# Altium schematic sheet Large_Connector.SchDoc
size A4; SheetNumber: 8; SheetTotal: 10
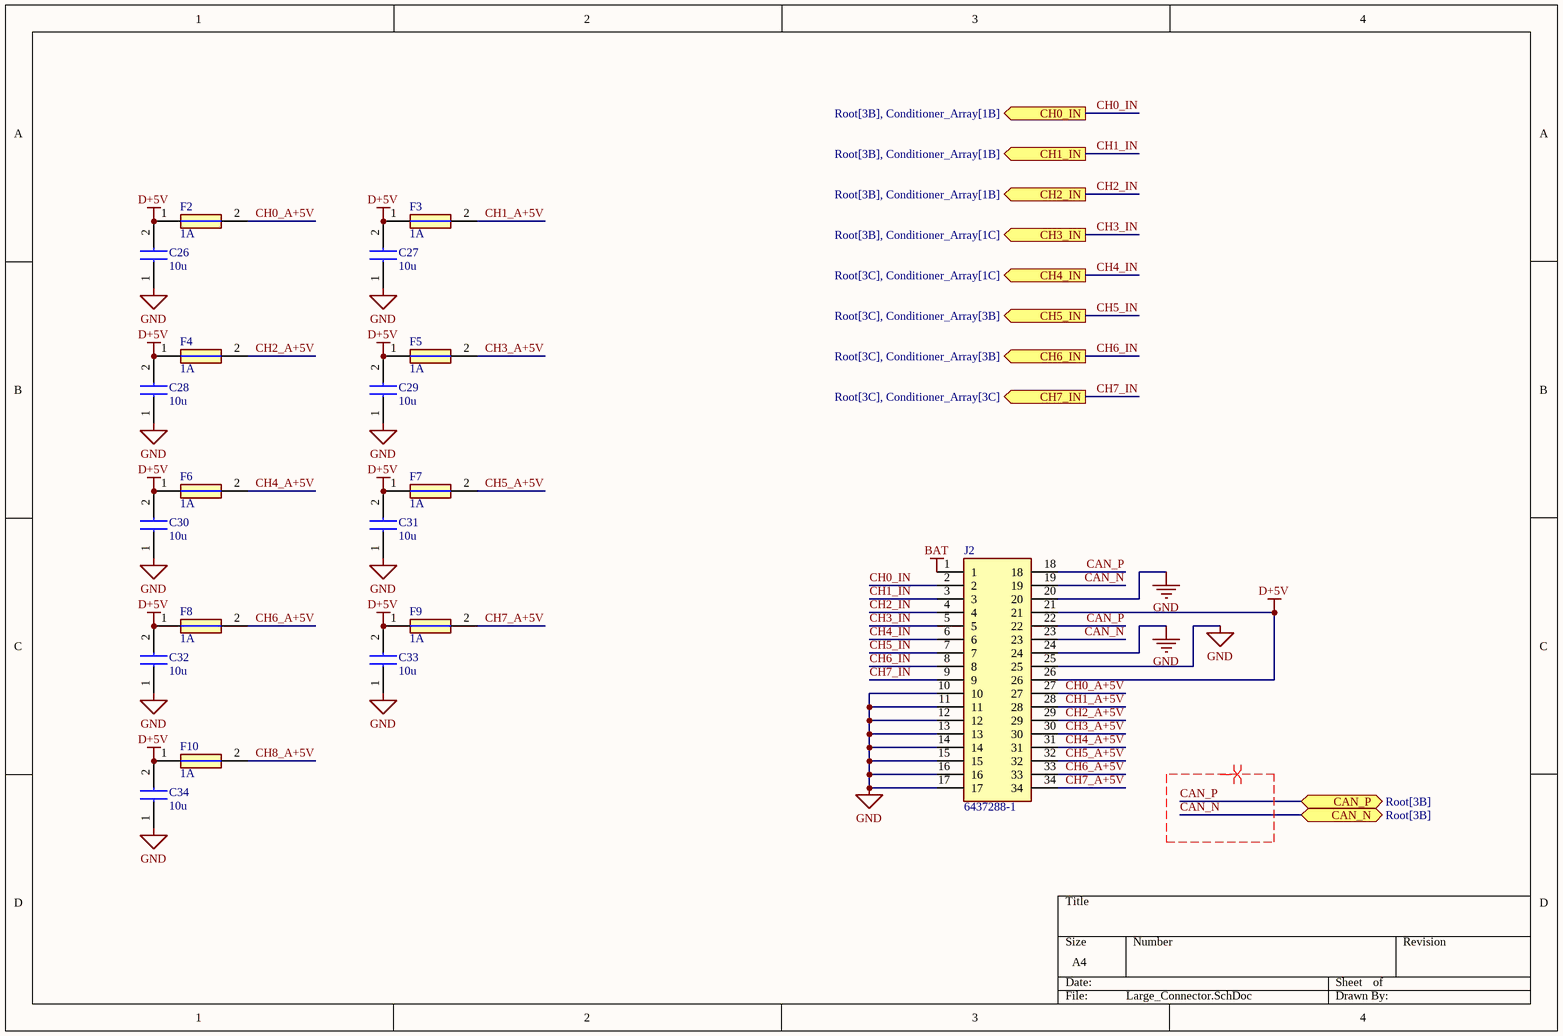
[diagram p0: Large_Connector.SchDoc]

## Parts
C26  10u  [GRM18x]
C27  10u  [GRM18x]
C28  10u  [GRM18x]
C29  10u  [GRM18x]
C30  10u  [GRM18x]
C31  10u  [GRM18x]
C32  10u  [GRM18x]
C33  10u  [GRM18x]
C34  10u  [GRM18x]
F2  1A  [ERBRE0R50V]
F3  1A  [ERBRE0R50V]
F4  1A  [ERBRE0R50V]
F5  1A  [ERBRE0R50V]
F6  1A  [ERBRE0R50V]
F7  1A  [ERBRE0R50V]
F8  1A  [ERBRE0R50V]
F9  1A  [ERBRE0R50V]
F10  1A  [ERBRE0R50V]
J2  6437288-1  [6437288-1]

## Ports
CAN_N (bidir, see Root[3B]), CAN_P (bidir, see Root[3B]), CH0_IN (out, see Root[3B], Conditioner_Array[1B]), CH1_IN (out, see Root[3B], Conditioner_Array[1B]), CH2_IN (out, see Root[3B], Conditioner_Array[1B]), CH3_IN (out, see Root[3B], Conditioner_Array[1C]), CH4_IN (out, see Root[3C], Conditioner_Array[1C]), CH5_IN (out, see Root[3C], Conditioner_Array[3B]), CH6_IN (out, see Root[3C], Conditioner_Array[3B]), CH7_IN (out, see Root[3C], Conditioner_Array[3C])

## Nets
BAT: J2.1
D+5V: C26.2 C27.2 C28.2 C29.2 C30.2 C31.2 C32.2 C33.2 C34.2 F2.1 F3.1 F4.1 F5.1 F6.1 F7.1 F8.1 F9.1 F10.1 J2.21 J2.26
GND: C26.1 C27.1 C28.1 C29.1 C30.1 C31.1 C32.1 C33.1 C34.1 J2.10 J2.11 J2.12 J2.13 J2.14 J2.15 J2.16 J2.17 J2.20 J2.24 J2.25
CAN_N: J2.19 J2.23 ; port CAN_N
CAN_P: J2.18 J2.22 ; port CAN_P
CH0_A+5V: F2.2 J2.27
CH0_IN: J2.2 ; port CH0_IN
CH1_A+5V: F3.2 J2.28
CH1_IN: J2.3 ; port CH1_IN
CH2_A+5V: F4.2 J2.29
CH2_IN: J2.4 ; port CH2_IN
CH3_A+5V: F5.2 J2.30
CH3_IN: J2.5 ; port CH3_IN
CH4_A+5V: F6.2 J2.31
CH4_IN: J2.6 ; port CH4_IN
CH5_A+5V: F7.2 J2.32
CH5_IN: J2.7 ; port CH5_IN
CH6_A+5V: F8.2 J2.33
CH6_IN: J2.8 ; port CH6_IN
CH7_A+5V: F9.2 J2.34
CH7_IN: J2.9 ; port CH7_IN
CH8_A+5V: F10.2

## Layout directives
differential pair: CAN_N, CAN_P

## Library data of the parts
C26-C34 = GRM188R61A106ME69D: Manufacturer_Name: Murata Electronics; Datasheet Link: https://search.murata.co.jp/Ceramy/image/img/A01X/G101/ENG/GRM188R61A106ME69-01A.pdf; Height: 0.8mm; Manufacturer_Part_Number: GRM188R61A106ME69D; Mouser Part Number: 81-GRM188R61A106ME9D; Mouser Price/Stock: https://www.mouser.co.uk/ProductDetail/Murata-Electronics/GRM188R61A106ME69D?qs=o98hbGm2QKGN31NsNZp5HQ%3D%3D; Arrow Part Number: GRM188R61A106ME69D; Arrow Price/Stock: https://www.arrow.com/en/products/grm188r61a106me69d/murata-manufacturing?region=nac
F2-F10 = ERB-RE1R00V: Manufacturer_Name: Panasonic; Datasheet Link: https://industrial.panasonic.com/cdbs/www-data/pdf/AFA0000/AFA0000C7.pdf; Height: 0.64mm; Manufacturer_Part_Number: ERB-RE1R00V; Mouser Part Number: 667-ERB-RE1R00V; Mouser Price/Stock: https://www.mouser.co.uk/ProductDetail/Panasonic/ERB-RE1R00V?qs=YIEcsSB2Lz5z%252BYSnyVyHaw%3D%3D; Arrow Part Number: ERB-RE1R00V; Arrow Price/Stock: https://www.arrow.com/en/products/erb-re1r00v/panasonic?region=nac
J2 = 6437288-1: Connector; Manufacturer_Name: TE Connectivity; Datasheet Link: https://www.te.com/commerce/DocumentDelivery/DDEController?Action=srchrtrv&DocNm=1-1773950-7&DocType=Data%20Sheet&DocLang=English&PartCntxt=6437288-1&DocFormat=pdf; Manufacturer_Part_Number: 6437288-1; Mouser Part Number: 571-6437288-1; Mouser Price/Stock: https://www.mouser.co.uk/ProductDetail/TE-Connectivity/6437288-1?qs=WBj8811fzwGYtKR8aBSJZw%3D%3D; Arrow Part Number: 6437288-1; Arrow Price/Stock: https://www.arrow.com/en/products/6437288-1/te-connectivity?region=nac